# Altium project PCB_Project.PrjPcb
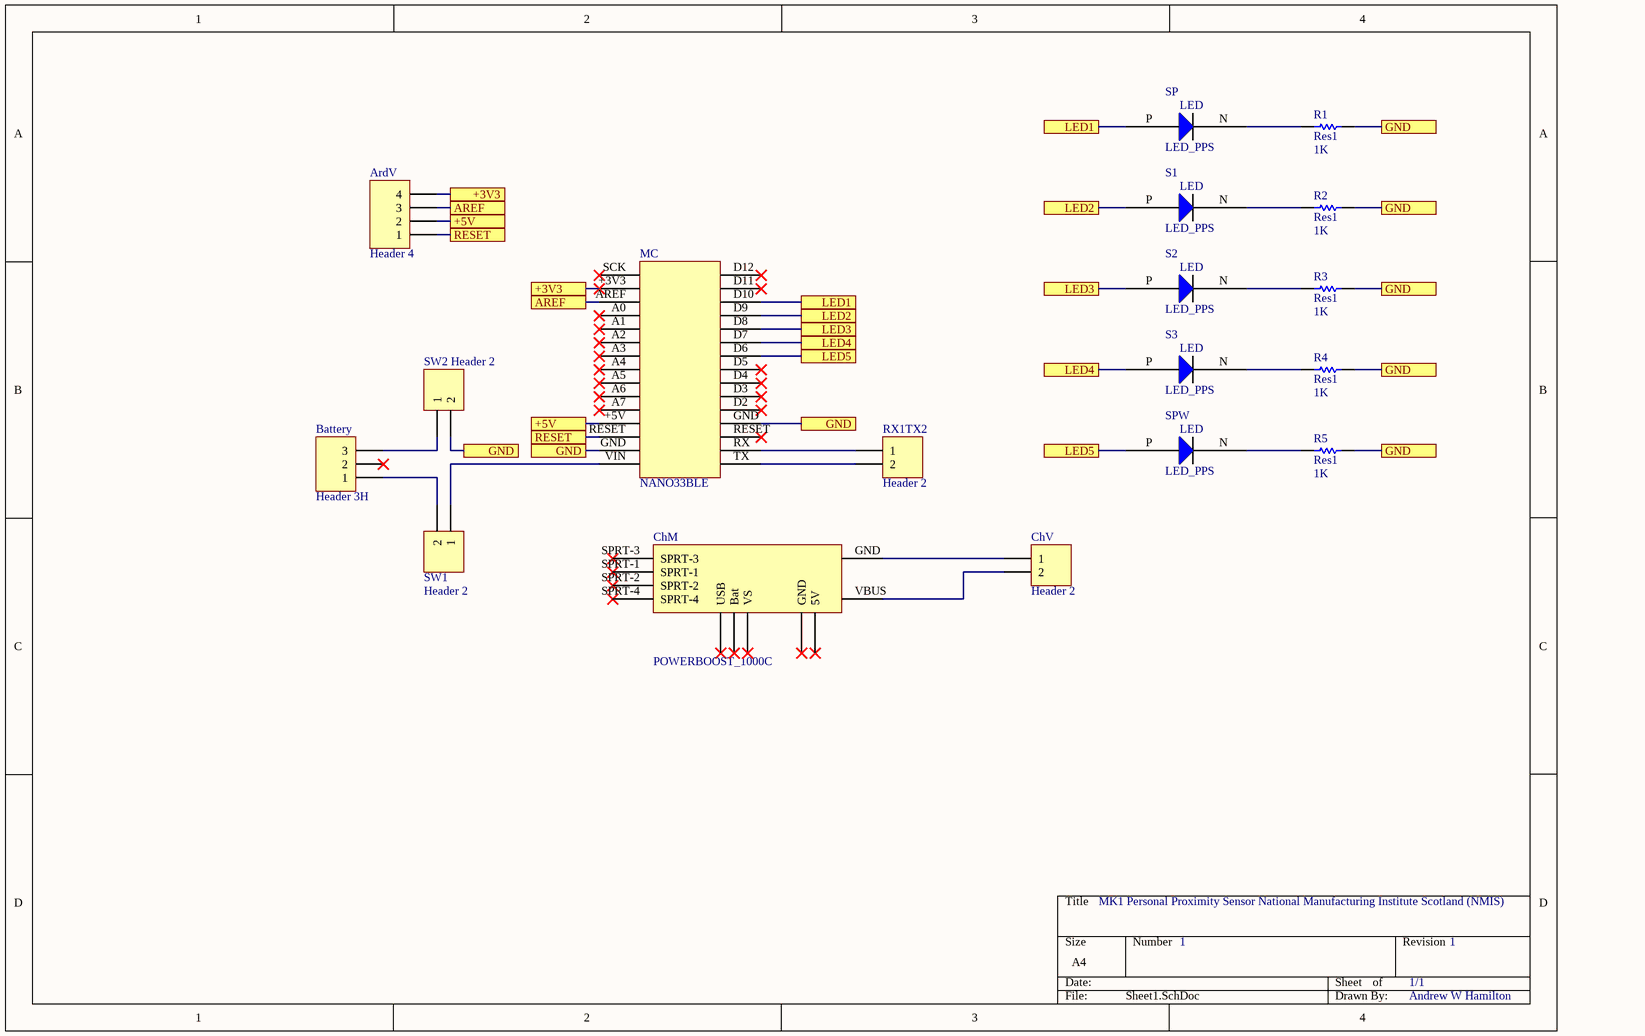
[diagram p0: Sheet1.SchDoc]
1 sheet, 18 parts. Net scope: flat (ports and power ports of the same name join across sheets).
Board file: PCB1.PcbDoc

## Sheet Sheet1.SchDoc
size A4

### Parts
ArdV  Header 4  [HDR1X4]
Battery  Header 3H  [HDR1X3H]
ChM  POWERBOOST_1000C  [POWERBOOST_1000C]
ChV  Header 2  [HDR1X2]
MC  NANO33BLE  [ARDUINO_NANO_BLE_33]
R1  Res1  value 1K  [AXIAL-0.3]
R2  Res1  value 1K  [AXIAL-0.3]
R3  Res1  value 1K  [AXIAL-0.3]
R4  Res1  value 1K  [AXIAL-0.3]
R5  Res1  value 1K  [AXIAL-0.3]
RX1TX2  Header 2  [HDR1X2]
S1  LED_PPS  [LED_PPS]
S2  LED_PPS  [LED_PPS]
S3  LED_PPS  [LED_PPS]
SP  LED_PPS  [LED_PPS]
SPW  LED_PPS  [LED_PPS]
SW1  Header 2  [HDR1X2]
SW2  Header 2  [HDR1X2]

### Ports
+3V3, +5V, AREF, GND, LED1, LED2, LED3, LED4, LED5, RESET

### Nets
NetArdV_1: ArdV.1 MC.RESET ; port RESET
NetArdV_2: ArdV.2 MC.+5V ; port +5V
NetArdV_3: ArdV.3 MC.AREF ; port AREF
NetArdV_4: ArdV.4 MC.+3V3 ; port +3V3
NetBattery_1: Battery.1 SW1.2
NetBattery_3: Battery.3 SW2.1
NetChM_GND: ChM.GND ChV.1
NetChM_VBUS: ChM.VBUS ChV.2
NetMC_D6: MC.D6 SPW.P ; port LED5
NetMC_D7: MC.D7 S3.P ; port LED4
NetMC_D8: MC.D8 S2.P ; port LED3
NetMC_D9: MC.D9 S1.P ; port LED2
NetMC_D10: MC.D10 SP.P ; port LED1
NetMC_GND: MC.GND R1.2 R2.2 R3.2 R4.2 R5.2 SW2.2 ; port GND
NetMC_RX: MC.RX RX1TX2.1
NetMC_TX: MC.TX RX1TX2.2
NetMC_VIN: MC.VIN SW1.1
NetR1_1: R1.1 SP.N
NetR2_1: R2.1 S1.N
NetR3_1: R3.1 S2.N
NetR4_1: R4.1 S3.N
NetR5_1: R5.1 SPW.N

Not connected (* = marked no-connect by the designer): Battery 2*; ChM 5V* Bat* SPRT-1* SPRT-2* SPRT-3* SPRT-4* USB* VS*; MC A0(4)* A1(5)* A2(6)* A3(7)* A4(8)* A5(9)* A6(10)* A7(11)* D2(26)* D3(25)* D4(24)* D5(23)* D11(_)* D12(16)* SCK(1)*

### Notes on the sheet
- MK1 Personal Proximity Sensor National Manufacturing Institute Scotland (NMIS)
- 1
- 1/1
- Andrew W Hamilton
- (in symbol LED_PPS) LED
- (in symbol POWERBOOST_1000C) PB1000C

### Library data of the parts
ArdV = Header 4: Header, 4-Pin; LatestRevisionDate: 17-Jul-2002; LatestRevisionNote: Re-released for DXP Platform.; Publisher: Altium Limited
Battery = Header 3H: Header, 3-Pin, Right Angle; LatestRevisionDate: 17-Jul-2002; LatestRevisionNote: Re-released for DXP Platform.; Publisher: Altium Limited
ChV RX1TX2 SW1 SW2 = Header 2: Header, 2-Pin; LatestRevisionDate: 17-Jul-2002; LatestRevisionNote: Re-released for DXP Platform.; Publisher: Altium Limited
R1-R5 = Res1: Resistor; Published: 8-Jun-2000; LatestRevisionDate: 17-Jul-2002; LatestRevisionNote: Re-released for DXP Platform.; PackageReference: AXIAL-0.3; Publisher: Altium Limited; PackageDescription: Axial Device, Thru-Hole; 2 Leads; 0.3 in Pin Spacing